# Altium project AD.PrjPcb
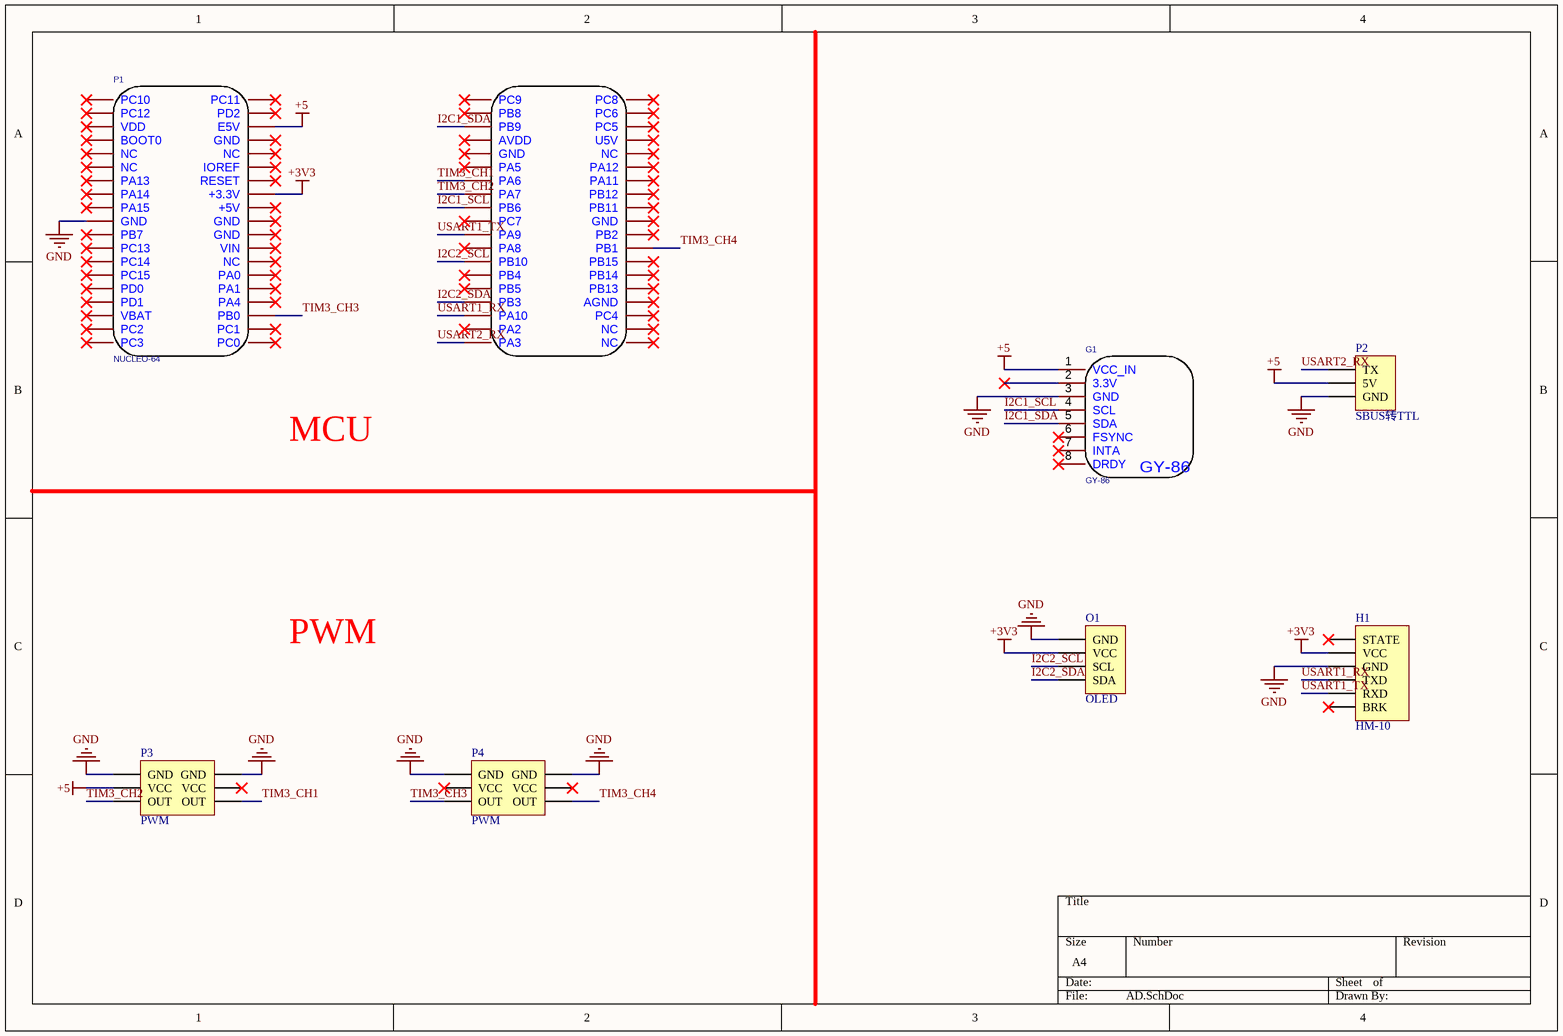
[diagram p0: AD.SchDoc]
1 sheet, 7 parts. Net scope: global (net labels, ports and power ports of the same name join across sheets).
Board file: AD.PcbDoc

## Sheet AD.SchDoc
size A4; SheetNumber: 1; SheetTotal: 1; SPICEModelCacheQLHLZMXI: <root> / <DocumentId>QLHLZMXI</DocumentId> / </root>

### Parts
G1  GY-86  [GY-86]
H1  HM-10  [HDR1X6]
O1  OLED  [HDR1X4]
P1  NUCLEO-64  [NUCLEO-F103RB]
P2  SBUS转TTL  [HDR1X3]
P3  PWM  [HDR2.54-WI-2x3P]
P4  PWM  [HDR2.54-WI-2x3P]

### Nets
+3V3: H1.2(VCC) O1.2(VCC) P1.16(+3.3V)
+5: G1.1(VCC_IN) P1.6(E5V) P2.2(5V) P3.3(VCC)
GND: G1.3(GND) H1.3(GND) O1.1(GND) P1.19(GND) P2.3(GND) P3.1(GND) P3.2(GND) P4.1(GND) P4.2(GND)
I2C1_SCL: G1.4(SCL) P1.89(PB6)
I2C1_SDA: G1.5(SDA) P1.77(PB9)
I2C2_SCL: O1.3(SCL) P1.97(PB10)
I2C2_SDA: O1.4(SDA) P1.103(PB3)
TIM3_CH1: P1.85(PA6) P3.6(OUT)
TIM3_CH2: P1.87(PA7) P3.5(OUT)
TIM3_CH3: P1.34(PB0) P4.5(OUT)
TIM3_CH4: P1.96(PB1) P4.6(OUT)
USART1_RX: H1.4(TXD) P1.105(PA10)
USART1_TX: H1.5(RXD) P1.93(PA9)
USART2_RX: P1.109(PA3) P2.1(TX)

Not connected (* = marked no-connect by the designer): G1 2(3.3V)* 6(FSYNC)* 7(INTA)* 8(DRDY)*; H1 1(STATE)* 6(BRK)*; P1 1(PC10)* 2(PC11)* 3(PC12)* 4(PD2)* 5(VDD)* 7(BOOT0)* 8(GND)* 9(NC)* 10(NC)* 11(NC)* 12(IOREF)* 13(PA13)* 14(RESET)* 15(PA14)* 17(PA15)* 18(+5V)* 20(GND)* 21(PB7)* 22(GND)* 23(PC13)* 24(VIN)* 25(PC14)* 26(NC)* 27(PC15)* 28(PA0)* 29(PD0)* 30(PA1)* 31(PD1)* 32(PA4)* 33(VBAT)* 35(PC2)* 36(PC1)* 37(PC3)* 38(PC0)* 73(PC9)* 74(PC8)* 75(PB8)* 76(PC6)* 78(PC5)* 79(AVDD)* 80(U5V)* 81(GND)* 82(NC)* 83(PA5)* 84(PA12)* 86(PA11)* 88(PB12)* 90(PB11)* 91(PC7)* 92(GND)* 94(PB2)* 95(PA8)* 98(PB15)* 99(PB4)* 100(PB14)* 101(PB5)* 102(PB13)* 104(AGND)* 106(PC4)* 107(PA2)* 108(NC)* 110(NC)*; P3 4(VCC)*; P4 3(VCC)* 4(VCC)*

### Notes on the sheet
- MCU
- PWM

### Library data of the parts
G1 = GY-86: GY-86模块; AddInBom: yes; Symbol: GY-86; Device: GY-86; FootprintName: GY-86
H1 = HM-10: HM-10蓝牙模块; LatestRevisionDate: 17-Jul-2002; LatestRevisionNote: Re-released for DXP Platform.; Publisher: Altium Limited
O1 = OLED: 使用I2C通信的0.96寸OLED模块; LatestRevisionDate: 17-Jul-2002; LatestRevisionNote: Re-released for DXP Platform.; Publisher: Altium Limited
P1 = NUCLEO-64: STM32F401NUCLEO开发板; Manufacturer: ST; AddInBom: yes; Symbol: NUCLEO-64; Device: NUCLEO-64; FootprintName: NUCLEO-F103RB; SupplierPart: NUCLEO-F103rb; Supplier: Mouser
P2 = SBUS转TTL: SBUS转TTL模块; LatestRevisionDate: 17-Jul-2002; LatestRevisionNote: Re-released for DXP Platform.; Publisher: Altium Limited
P3 P4 = PWM: 电机PWM输出; LatestRevisionDate: 17-Jul-2002; LatestRevisionNote: Re-released for DXP Platform.; Publisher: Altium Limited